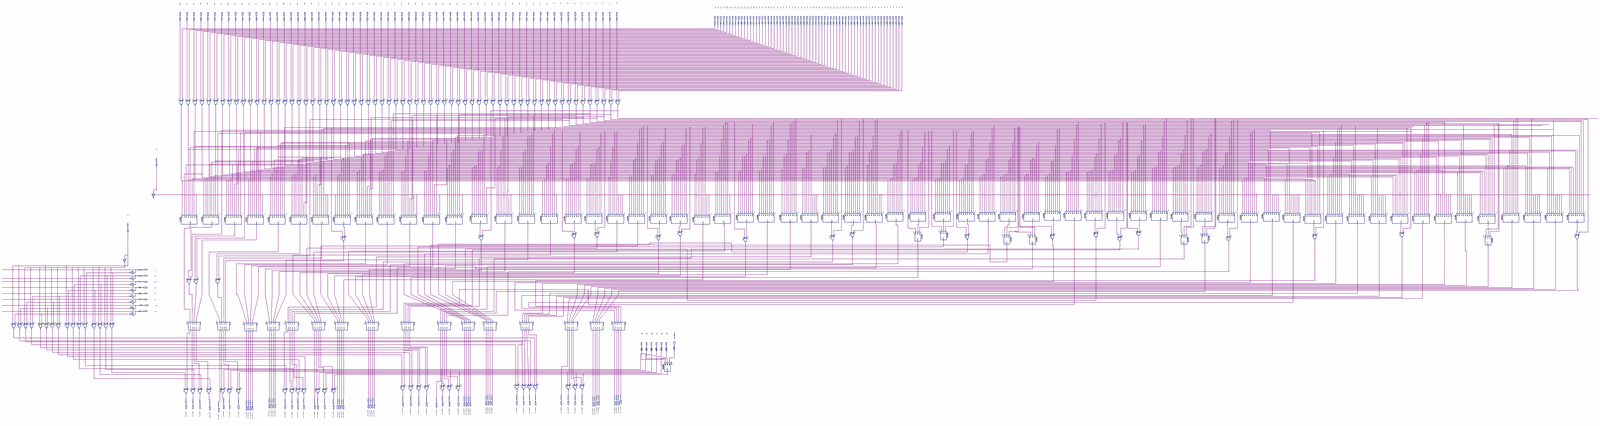
[diagram p0: schematic sheet, whole]
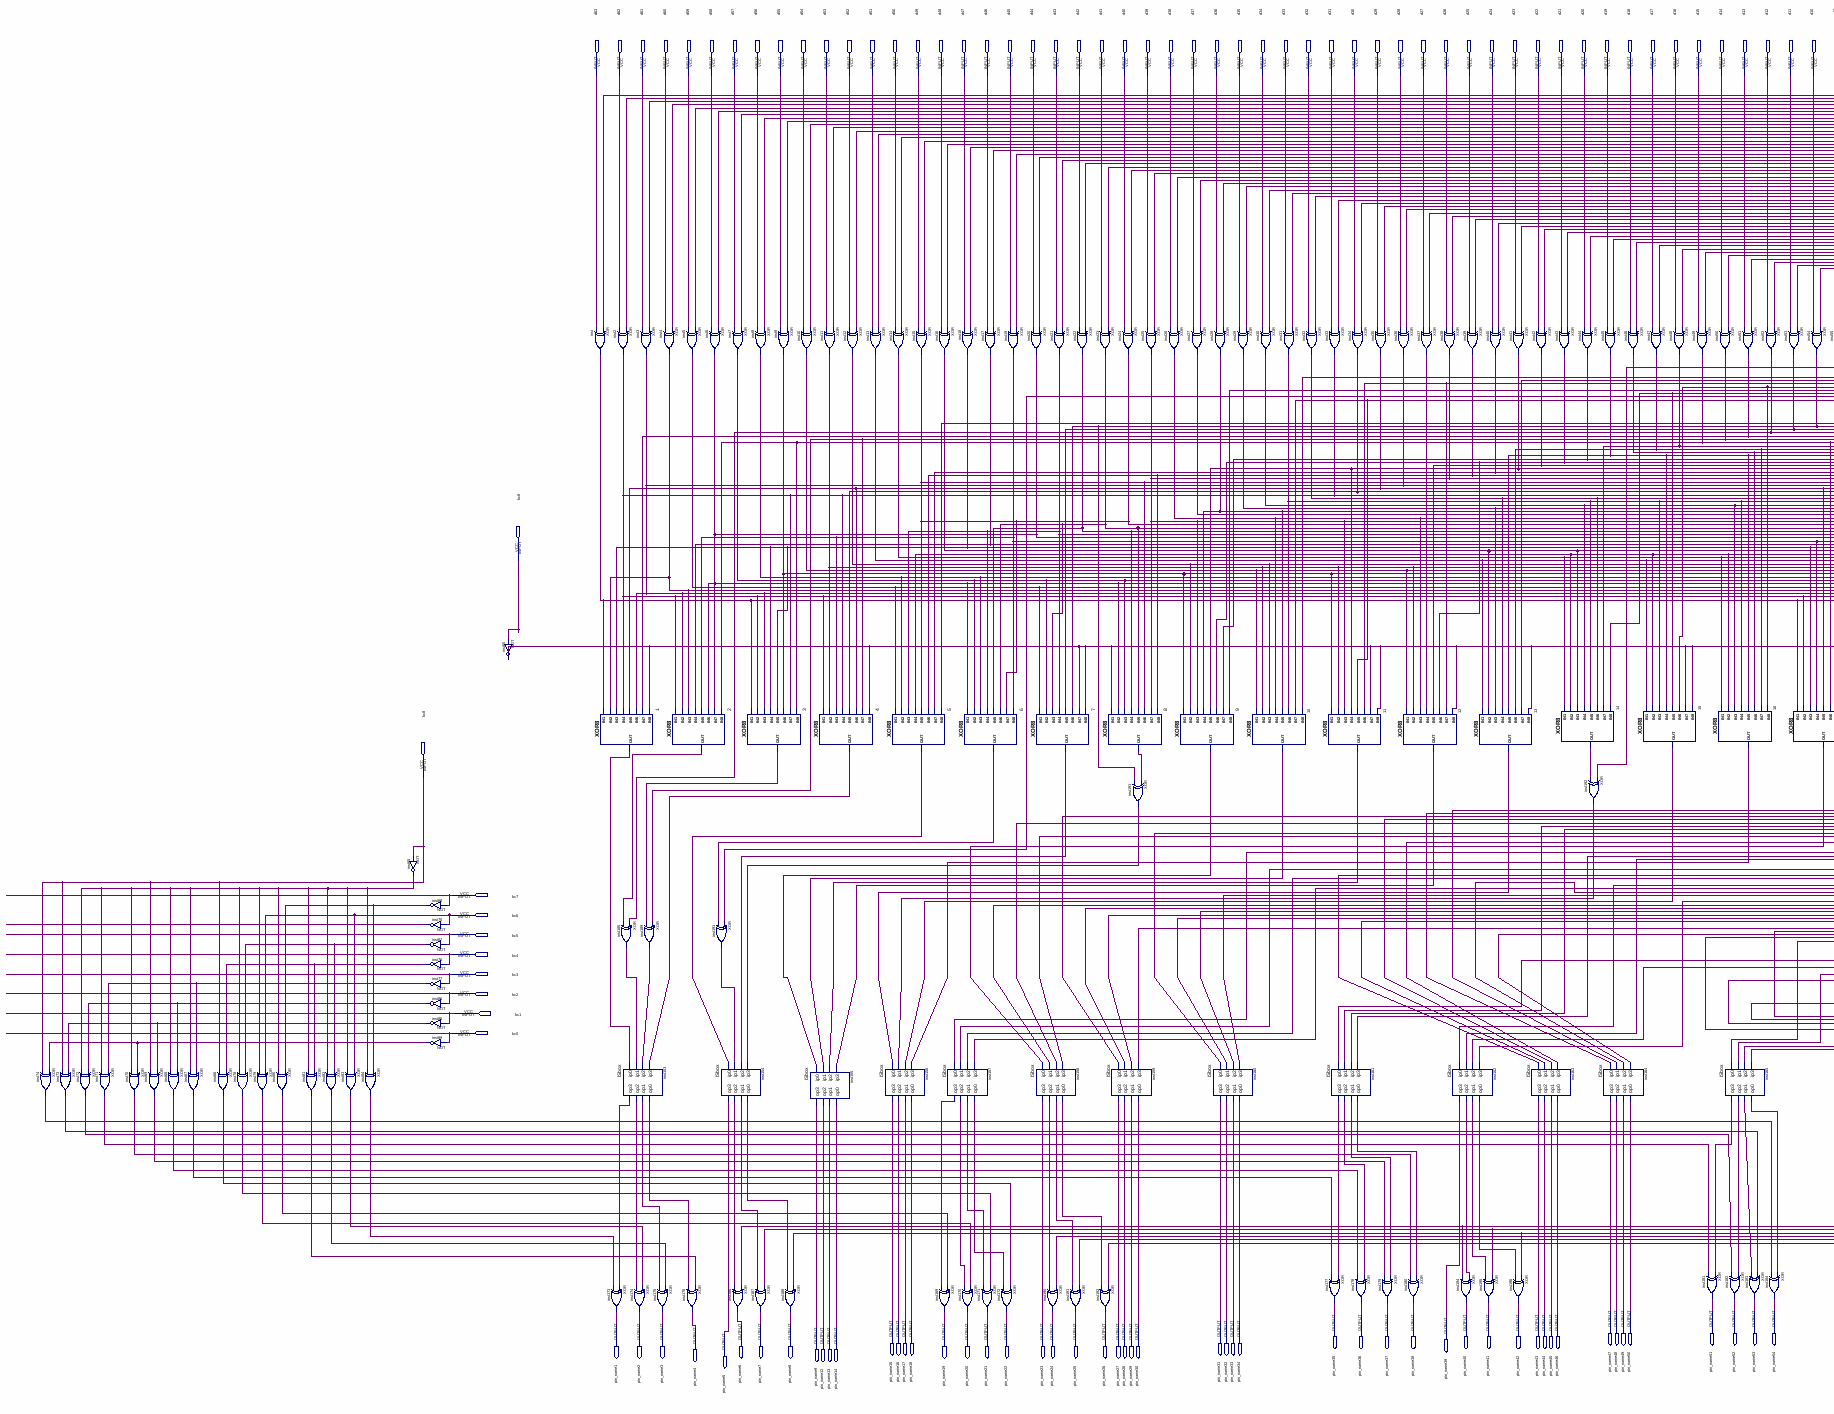
[diagram p1: schematic sheet, left part]
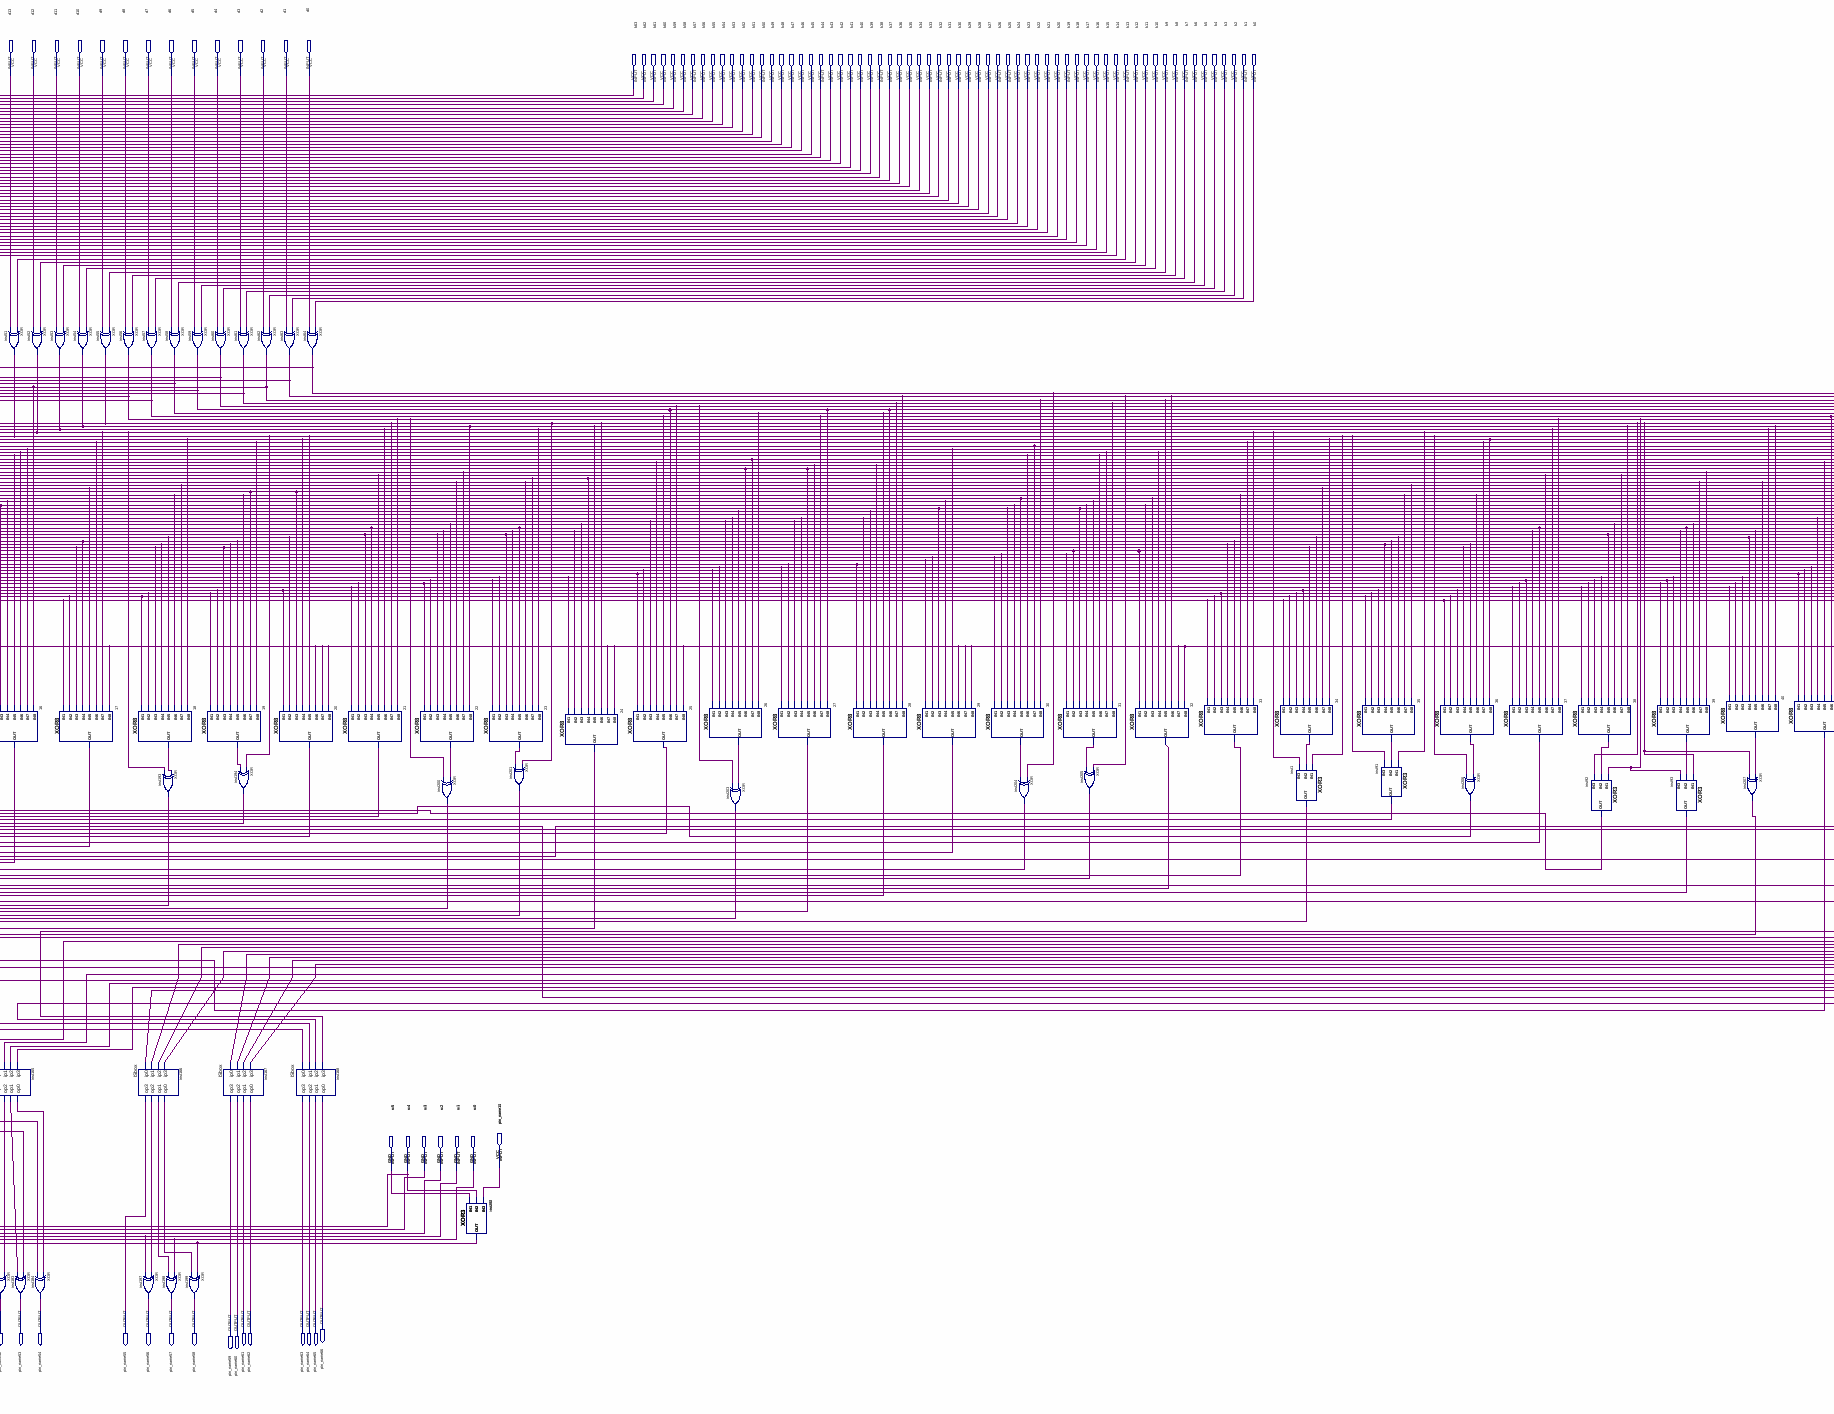
[diagram p2: schematic sheet, centre part]
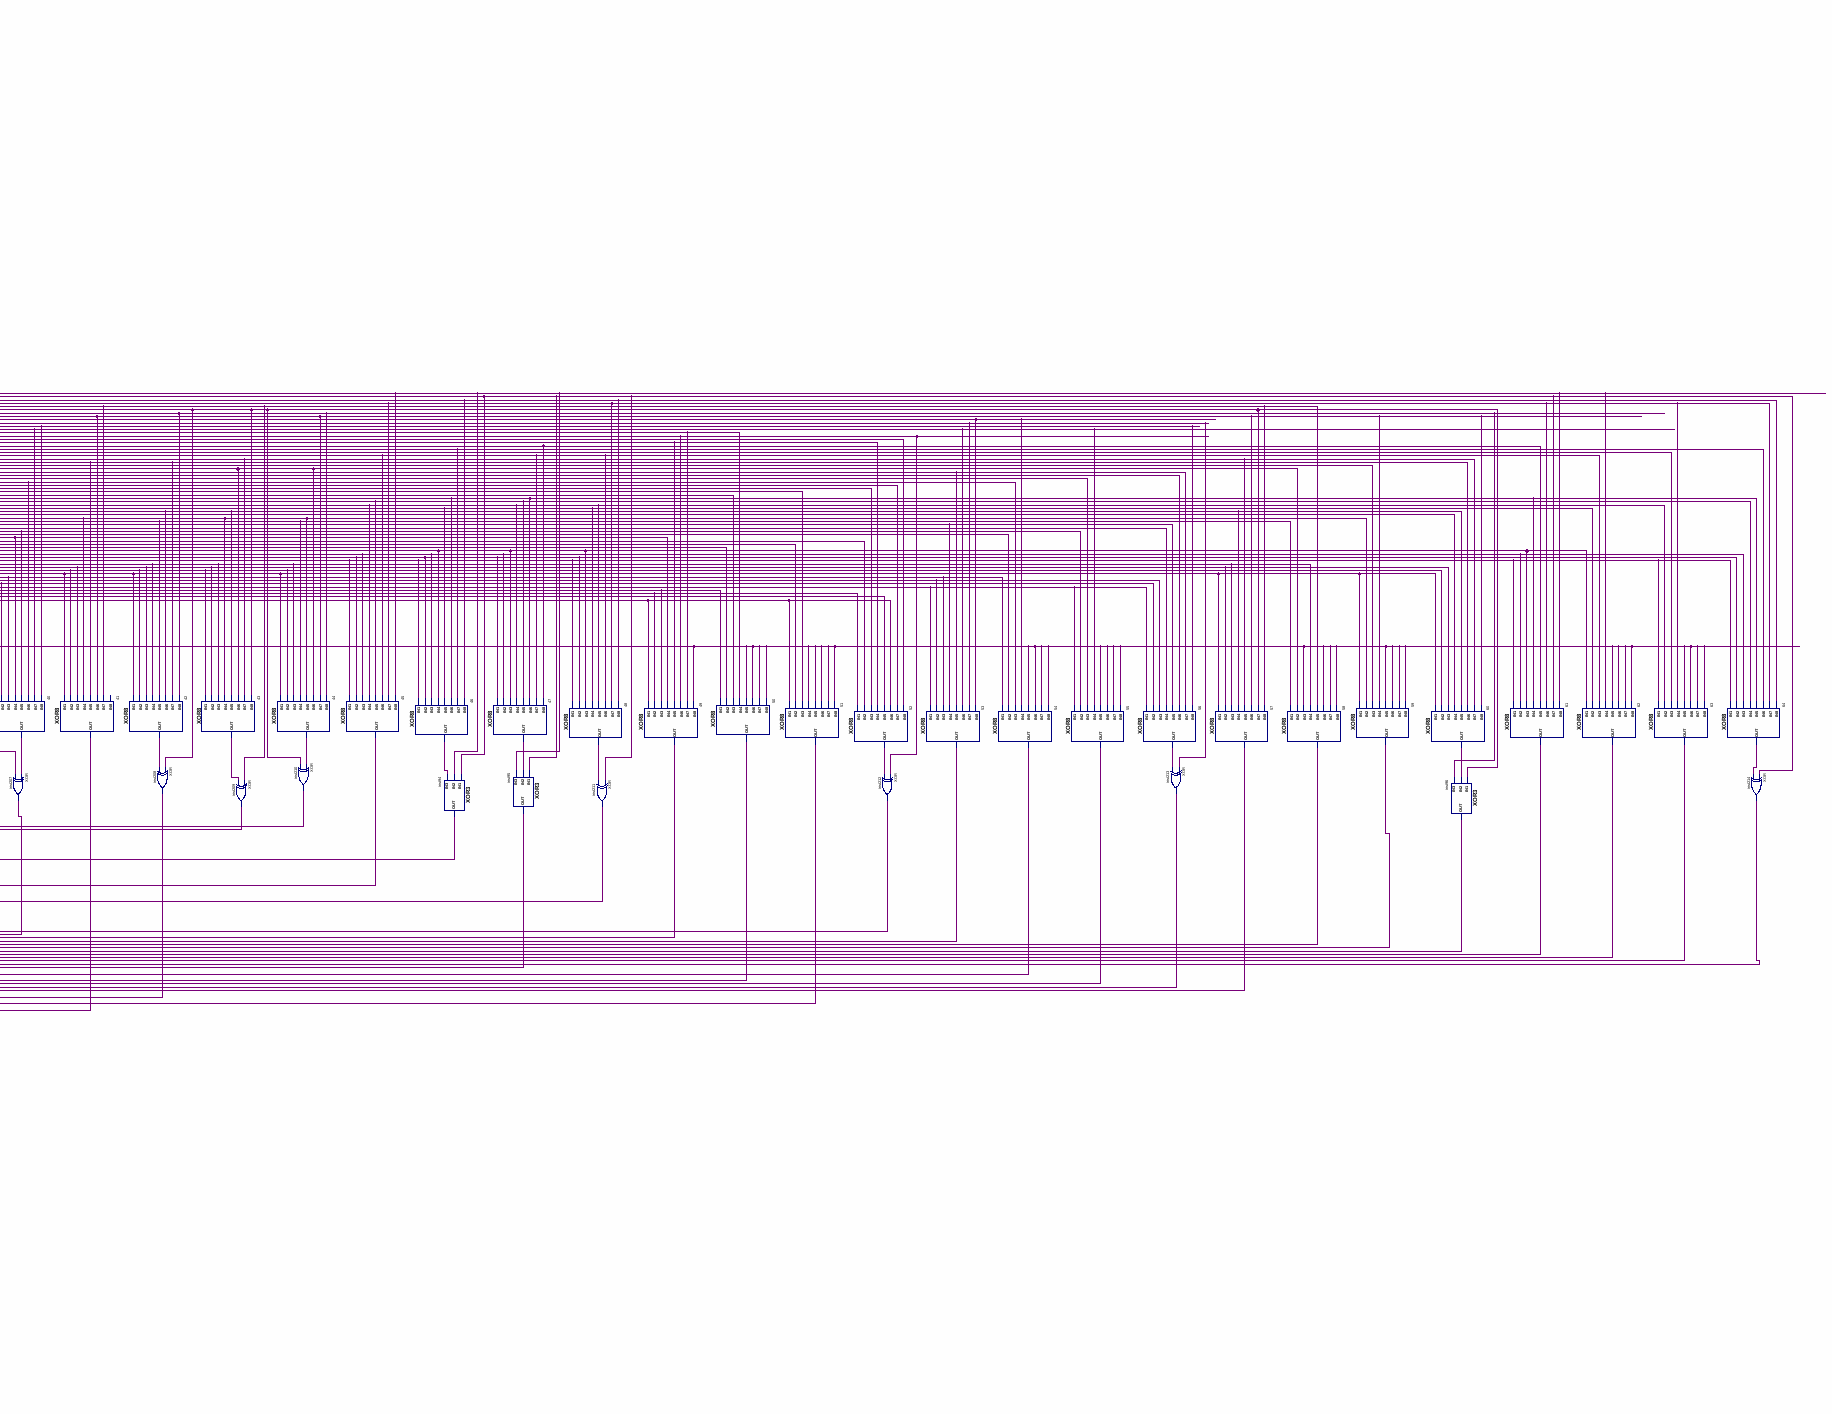
[diagram p3: schematic sheet, right part]
// Quartus schematic plain text.bdf as structural Verilog: 228 symbols, 216 pins
module \plain_text  (
  input  d63,
  input  d62,
  input  d61,
  input  d60,
  input  d59,
  input  d58,
  input  d57,
  input  d56,
  input  d55,
  input  d54,
  input  d53,
  input  d52,
  input  d51,
  input  d50,
  input  d49,
  input  d48,
  input  d47,
  input  d46,
  input  d45,
  input  d44,
  input  d43,
  input  d42,
  input  d41,
  input  d40,
  input  d39,
  input  d38,
  input  d37,
  input  d36,
  input  d35,
  input  d34,
  input  d33,
  input  d32,
  input  d31,
  input  d30,
  input  d29,
  input  d28,
  input  d27,
  input  d26,
  input  d25,
  input  d24,
  input  d23,
  input  d22,
  input  d21,
  input  d20,
  input  d19,
  input  d18,
  input  d17,
  input  d16,
  input  d15,
  input  d14,
  input  d13,
  input  d12,
  input  d11,
  input  d10,
  input  d9,
  input  d8,
  input  d7,
  input  d6,
  input  d5,
  input  d4,
  input  d3,
  input  d2,
  input  d1,
  input  d0,
  input  k63,
  input  k62,
  input  k61,
  input  k60,
  input  k59,
  input  k58,
  input  k57,
  input  k56,
  input  k55,
  input  k54,
  input  k53,
  input  k52,
  input  k51,
  input  k50,
  input  k49,
  input  k48,
  input  k47,
  input  k46,
  input  k45,
  input  k44,
  input  k43,
  input  k42,
  input  k41,
  input  k40,
  input  k39,
  input  k38,
  input  k37,
  input  k36,
  input  k35,
  input  k34,
  input  k33,
  input  k32,
  input  k31,
  input  k30,
  input  k29,
  input  k28,
  input  k27,
  input  k26,
  input  k25,
  input  k24,
  input  k23,
  input  k22,
  input  k21,
  input  k20,
  input  k19,
  input  k18,
  input  k17,
  input  k16,
  input  k15,
  input  k14,
  input  k13,
  input  k12,
  input  k11,
  input  k10,
  input  k9,
  input  k8,
  input  k7,
  input  k6,
  input  k5,
  input  k4,
  input  k3,
  input  k2,
  input  k1,
  input  k0,
  input  kc8,
  input  kc7,
  input  kc6,
  input  kc5,
  input  kc4,
  input  kc3,
  input  kc2,
  input  kc1,
  input  kc0,
  input  pin_name10,
  input  pin_name11,
  input  rc5,
  input  rc4,
  input  rc3,
  input  rc2,
  input  rc1,
  input  rc0,
  output pin_name66,
  output pin_name47,
  output pin_name48,
  output pin_name49,
  output pin_name50,
  output pin_name51,
  output pin_name52,
  output pin_name53,
  output pin_name54,
  output pin_name55,
  output pin_name56,
  output pin_name57,
  output pin_name58,
  output pin_name61,
  output pin_name62,
  output pin_name63,
  output pin_name64,
  output pin_name65,
  output pin_name35,
  output pin_name36,
  output pin_name37,
  output pin_name38,
  output pin_name40,
  output pin_name41,
  output pin_name42,
  output pin_name43,
  output pin_name44,
  output pin_name45,
  output pin_name46,
  output pin_name59,
  output pin_name60,
  output pin_name39,
  output pin_name15,
  output pin_name16,
  output pin_name17,
  output pin_name18,
  output pin_name31,
  output pin_name32,
  output pin_name33,
  output pin_name34,
  output pin_name1,
  output pin_name2,
  output pin_name3,
  output pin_name6,
  output pin_name7,
  output pin_name8,
  output pin_name19,
  output pin_name20,
  output pin_name21,
  output pin_name22,
  output pin_name23,
  output pin_name24,
  output pin_name25,
  output pin_name26,
  output pin_name27,
  output pin_name28,
  output pin_name29,
  output pin_name30,
  output pin_name4,
  output pin_name9,
  output pin_name12,
  output pin_name13,
  output pin_name14,
  output pin_name5
);

  wire inst1_out, inst2_out, inst3_out, inst4_out, inst5_out, inst6_out, inst7_out, inst8_out, inst9_out,
       inst10_out, inst11_out, inst12_out, inst13_out, inst14_out, inst15_out, inst16_out, inst17_out,
       inst18_out, inst19_out, inst21_out, inst22_out, inst23_out, inst25_out, inst26_out, inst27_out,
       inst28_out, inst29_out, inst30_out, inst31_out, inst32_out, inst34_out, inst35_out, inst39_out,
       inst40_out, inst41_out, inst42_out, inst43_out, inst44_out, inst45_out, inst46_out, inst47_out,
       inst48_out, inst49_out, inst50_out, inst51_out, inst52_out, inst53_out, inst54_out, inst55_out,
       inst56_out, inst57_out, inst58_out, inst59_out, inst60_out, inst61_out, inst62_out, inst63_out,
       inst64_out, inst65_out, inst65_out_2, inst66_out, inst67_out, inst68_out, inst69_out, inst70_out,
       inst71_out, inst72_out, inst73_out, inst74_out, inst75_out, inst76_out, inst77_out, inst78_out,
       inst79_out, inst80_out, inst81_out, inst82_out, inst83_out, inst84_out, inst85_out, inst86_out,
       inst87_out, inst88_out, inst89_out, inst90_out, inst91_out, inst92_out, inst93_out, inst94_out,
       inst95_out, inst96_out, inst153_op0, inst153_op1, inst153_op2, inst153_op3, inst154_op0, inst154_op1,
       inst154_op2, inst157_op0, inst157_op1, inst157_op2, inst157_op3, inst158_op0, inst158_op1,
       inst158_op2, inst161_op0, inst161_op1, inst161_op2, inst161_op3, inst162_op0, inst162_op1,
       inst162_op2, inst165_op0, inst165_op1, inst165_op2, inst165_op3, inst166_op0, inst166_op1,
       inst166_op2, inst185_out, inst189_out, inst191_out, inst191_out_2, inst192_out, inst193_out,
       inst194_out, inst200_out, inst201_out, inst203_out, inst204_out, inst205_out, inst206_out,
       inst207_out, inst208_out, inst209_out, inst210_out, inst211_out, inst212_out, inst213_out,
       inst214_out, inst_out, n1_out, n2_out, n3_out, n4_out, n5_out, n6_out, n7_out, n8_out, n9_out,
       n10_out, n11_out, n12_out, n13_out, n14_out, n15_out, n16_out, n17_out, n18_out, n19_out, n20_out,
       n21_out, n22_out, n23_out, n24_out, n25_out, n26_out, n27_out, n28_out, n29_out, n30_out, n31_out,
       n32_out, n33_out, n34_out, n35_out, n36_out, n37_out, n38_out, n39_out, n40_out, n41_out, n42_out,
       n43_out, n44_out, n45_out, n46_out, n47_out, n48_out, n49_out, n50_out, n51_out, n52_out, n53_out,
       n54_out, n55_out, n56_out, n57_out, n58_out, n59_out, n60_out, n61_out, n62_out, n63_out, n64_out;

  xor inst73 (inst73_out, inst85_out, kc8);
  xor inst74 (inst74_out, inst89_out, kc8);
  xor inst72 (inst72_out, inst86_out, inst65_out);
  xor inst71 (inst71_out, inst77_out, inst65_out);
  xor inst70 (inst70_out, inst89_out, inst65_out);
  xor inst69 (inst69_out, inst85_out, kc8);
  xor inst67 (inst67_out, inst77_out, inst65_out);
  xor inst68 (inst68_out, inst86_out, inst65_out);
  xor inst66 (inst66_out, inst76_out, kc8);
  xor inst78 (inst78_out, inst87_out, inst65_out);
  xor inst79 (inst79_out, kc6, inst65_out);
  xor inst80 (inst80_out, inst88_out, inst65_out);
  xor inst81 (inst81_out, inst76_out, inst65_out);
  xor inst82 (inst82_out, inst87_out, inst65_out);
  xor inst83 (inst83_out, kc6, inst65_out);
  xor inst84 (inst84_out, inst88_out, inst65_out);
  not inst65 (inst65_out, kc8);
  not inst88 (inst88_out, kc7);
  not inst75 (inst75_out, kc6);
  not inst87 (inst87_out, kc5);
  not inst76 (inst76_out, kc4);
  not inst77 (inst77_out, kc3);
  not inst86 (inst86_out, kc2);
  not inst85 (inst85_out, kc1);
  not inst89 (inst89_out, kc0);
  not inst65_dup2 (inst65_out_2, kc8);
  xor inst (inst_out, k63, d63);
  XOR8 u_1 (
    .IN8(inst65_out_2), .IN1(inst_out), .IN7(inst51_out), .IN6(inst3_out), .IN5(inst35_out), .IN4(inst2_out),
    .IN3(inst18_out), .IN2(inst4_out), .OUT(n1_out));
  xor inst173 (pin_name1, inst153_op3, inst84_out);
  xor inst2 (inst2_out, k62, d62);
  xor inst185 (inst185_out, inst52_out, n2_out);
  ISbox inst153 (
    .ip0(n1_out), .ip1(inst185_out), .ip2(inst189_out), .ip3(n4_out), .op3(inst153_op3), .op2(inst153_op2),
    .op1(inst153_op1), .op0(inst153_op0));
  xor inst174 (pin_name2, inst83_out, inst153_op2);
  xor inst3 (inst3_out, k61, d61);
  xor inst4 (inst4_out, k60, d60);
  xor inst189 (inst189_out, inst50_out, n3_out);
  xor inst175 (pin_name3, inst82_out, inst153_op1);
  xor inst5 (inst5_out, k59, d59);
  XOR8 u_2 (
    .IN8(inst49_out), .IN1(inst2_out), .IN7(inst6_out), .IN6(inst6_out), .IN5(inst19_out), .IN4(inst17_out),
    .IN3(inst4_out), .IN2(inst3_out), .OUT(n2_out));
  xor inst176 (pin_name4, inst81_out, inst153_op0);
  xor inst6 (inst6_out, k58, d58);
  xor inst191 (inst191_out, inst56_out, n6_out);
  xor inst7 (inst7_out, k57, d57);
  ISbox inst154 (
    .ip0(n5_out), .ip1(inst191_out), .ip2(n7_out), .ip3(inst191_out_2), .op3(pin_name5), .op2(inst154_op2),
    .op1(inst154_op1), .op0(inst154_op0));
  xor inst186 (pin_name6, rc4, inst154_op2);
  xor inst8 (inst8_out, k56, d56);
  XOR8 u_3 (
    .IN8(inst49_out), .IN1(inst_out), .IN7(inst2_out), .IN6(inst9_out), .IN5(inst18_out), .IN4(inst18_out),
    .IN3(inst3_out), .IN2(inst2_out), .OUT(n3_out));
  xor inst187 (pin_name7, rc3, inst154_op1);
  xor inst9 (inst9_out, k55, d55);
  xor inst188 (pin_name8, rc2, inst154_op0);
  xor inst10 (inst10_out, k54, d54);
  XOR8 u_4 (
    .IN8(inst65_out_2), .IN1(inst2_out), .IN7(inst50_out), .IN6(inst35_out), .IN5(inst34_out),
    .IN4(inst2_out), .IN3(inst19_out), .IN2(inst11_out), .OUT(n4_out));
  ISbox inst155 (
    .ip0(n9_out), .ip1(n10_out), .ip2(n11_out), .ip3(n12_out), .op3(pin_name9), .op2(pin_name12),
    .op1(pin_name13), .op0(pin_name14));
  xor inst11 (inst11_out, k53, d53);
  xor inst12 (inst12_out, k52, d52);
  xor inst13 (inst13_out, k51, d51);
  xor inst14 (inst14_out, k50, d50);
  XOR8 u_5 (
    .IN8(inst55_out), .IN1(inst5_out), .IN7(inst40_out), .IN6(inst39_out), .IN5(inst15_out),
    .IN4(inst15_out), .IN3(inst21_out), .IN2(inst8_out), .OUT(n5_out));
  ISbox inst156 (
    .ip0(n13_out), .ip1(inst192_out), .ip2(n15_out), .ip3(n16_out), .op3(pin_name15), .op2(pin_name16),
    .op1(pin_name17), .op0(pin_name18));
  xor inst15 (inst15_out, k49, d49);
  xor inst16 (inst16_out, k48, d48);
  ISbox inst157 (
    .ip0(n29_out), .ip1(inst204_out), .ip2(inst205_out), .ip3(n32_out), .op3(inst157_op3), .op2(inst157_op2),
    .op1(inst157_op1), .op0(inst157_op0));
  xor inst169 (pin_name19, inst80_out, inst157_op3);
  xor inst18 (inst18_out, k47, d47);
  XOR8 u_6 (
    .IN8(inst19_out), .IN1(inst6_out), .IN7(inst15_out), .IN6(inst23_out), .IN5(inst22_out),
    .IN4(inst21_out), .IN3(inst8_out), .IN2(inst7_out), .OUT(n6_out));
  xor inst170 (pin_name20, inst79_out, inst157_op2);
  xor inst17 (inst17_out, k46, d46);
  xor inst171 (pin_name21, inst78_out, inst157_op1);
  xor inst172 (pin_name22, inst66_out, inst157_op0);
  xor inst19 (inst19_out, k45, d45);
  xor inst20 (inst6_out, k44, d44);
  xor inst21 (inst21_out, k43, d43);
  XOR8 u_7 (
    .IN8(inst65_out_2), .IN1(inst5_out), .IN7(inst65_out_2), .IN6(inst54_out), .IN5(inst53_out),
    .IN4(inst21_out), .IN3(inst23_out), .IN2(inst7_out), .OUT(n7_out));
  ISbox inst158 (
    .ip0(n17_out), .ip1(inst193_out), .ip2(inst194_out), .ip3(n20_out), .op3(pin_name23), .op2(inst158_op2),
    .op1(inst158_op1), .op0(inst158_op0));
  xor inst190 (pin_name24, rc1, inst158_op2);
  xor inst22 (inst22_out, k42, d42);
  xor inst191_dup2 (pin_name25, rc0, inst158_op1);
  xor inst23 (inst23_out, k41, d41);
  XOR8 u_8 (
    .IN8(inst39_out), .IN1(inst65_out_2), .IN7(inst25_out), .IN6(inst15_out), .IN5(inst23_out),
    .IN4(inst22_out), .IN3(inst7_out), .IN2(inst6_out), .OUT(n8_out));
  ISbox inst159 (
    .ip0(n21_out), .ip1(inst200_out), .ip2(inst201_out), .ip3(n24_out), .op3(pin_name27), .op2(pin_name28),
    .op1(pin_name29), .op0(pin_name30));
  xor inst192 (pin_name26, inst90_out, inst158_op0);
  xor inst24 (inst15_out, k40, d40);
  xor inst191_dup3 (inst191_out_2, n8_out, inst54_out);
  xor inst25 (inst25_out, k39, d39);
  xor inst26 (inst26_out, k38, d38);
  XOR8 u_9 (
    .IN8(inst59_out), .IN1(inst9_out), .IN7(inst44_out), .IN6(inst43_out), .IN5(inst41_out),
    .IN4(inst28_out), .IN3(inst25_out), .IN2(inst12_out), .OUT(n9_out));
  xor inst27 (inst27_out, k37, d37);
  xor inst28 (inst28_out, k36, d36);
  ISbox inst160 (
    .ip0(n25_out), .ip1(inst203_out), .ip2(n27_out), .ip3(n28_out), .op3(pin_name31), .op2(pin_name32),
    .op1(pin_name33), .op0(pin_name34));
  xor inst29 (inst29_out, k35, d35);
  xor inst30 (inst30_out, k34, d34);
  XOR8 u_10 (
    .IN8(inst60_out), .IN1(inst10_out), .IN7(inst57_out), .IN6(inst31_out), .IN5(inst28_out),
    .IN4(inst26_out), .IN3(inst12_out), .IN2(inst11_out), .OUT(n10_out));
  xor inst31 (inst31_out, k33, d33);
  xor inst32 (inst32_out, k32, d32);
  xor inst33 (inst2_out, k31, d31);
  XOR8 u_11 (
    .IN8(inst65_out_2), .IN1(inst9_out), .IN7(inst65_out_2), .IN6(inst58_out), .IN5(inst57_out),
    .IN4(inst41_out), .IN3(inst25_out), .IN2(inst11_out), .OUT(n11_out));
  ISbox inst161 (
    .ip0(n41_out), .ip1(inst208_out), .ip2(inst209_out), .ip3(inst210_out), .op3(inst161_op3),
    .op2(inst161_op2), .op1(inst161_op1), .op0(inst161_op0));
  xor inst177 (pin_name35, inst161_op3, inst67_out);
  xor inst34 (inst34_out, k30, d30);
  xor inst178 (pin_name36, inst161_op2, inst68_out);
  xor inst35 (inst35_out, k29, d29);
  xor inst36 (inst3_out, k28, d28);
  xor inst179 (pin_name37, inst161_op1, inst69_out);
  xor inst37 (inst15_out, k27, d27);
  XOR8 u_12 (
    .IN8(inst65_out_2), .IN1(inst10_out), .IN7(inst58_out), .IN6(inst43_out), .IN5(inst42_out),
    .IN4(inst15_out), .IN3(inst26_out), .IN2(inst11_out), .OUT(n12_out));
  xor inst180 (pin_name38, inst161_op0, inst70_out);
  xor inst38 (inst25_out, k26, d26);
  ISbox inst162 (
    .ip0(n45_out), .ip1(inst94_out), .ip2(inst95_out), .ip3(inst211_out), .op3(pin_name39),
    .op2(inst162_op2), .op1(inst162_op1), .op0(inst162_op0));
  xor inst39 (inst39_out, k25, d25);
  XOR8 u_13 (
    .IN8(inst65_out_2), .IN1(inst13_out), .IN7(inst63_out), .IN6(inst47_out), .IN5(inst45_out),
    .IN4(inst32_out), .IN3(inst29_out), .IN2(inst16_out), .OUT(n13_out));
  xor inst194 (pin_name40, inst162_op2, rc4);
  xor inst40 (inst40_out, k24, d24);
  xor inst195 (pin_name41, rc3, inst162_op1);
  xor inst41 (inst41_out, k23, d23);
  ISbox inst163 (
    .ip0(n33_out), .ip1(inst1_out), .ip2(inst91_out), .ip3(n37_out), .op3(pin_name43), .op2(pin_name44),
    .op1(pin_name45), .op0(pin_name46));
  xor inst196 (pin_name42, rc2, inst162_op0);
  xor inst42 (inst42_out, k22, d22);
  xor inst43 (inst43_out, k21, d21);
  xor inst44 (inst44_out, k20, d20);
  XOR8 u_14 (
    .IN8(inst61_out), .IN1(inst14_out), .IN7(inst48_out), .IN6(inst32_out), .IN5(inst31_out),
    .IN4(inst30_out), .IN3(inst16_out), .IN2(inst15_out), .OUT(n14_out));
  xor inst45 (inst45_out, k19, d19);
  xor inst192_dup2 (inst192_out, inst64_out, n14_out);
  ISbox inst164 (
    .ip0(inst206_out), .ip1(inst92_out), .ip2(inst93_out), .ip3(inst207_out), .op3(pin_name47),
    .op2(pin_name48), .op1(pin_name49), .op0(pin_name50));
  xor inst46 (inst46_out, k18, d18);
  xor inst47 (inst47_out, k17, d17);
  XOR8 u_15 (
    .IN8(inst65_out_2), .IN1(inst13_out), .IN7(inst65_out_2), .IN6(inst62_out), .IN5(inst61_out),
    .IN4(inst45_out), .IN3(inst31_out), .IN2(inst15_out), .OUT(n15_out));
  xor inst48 (inst48_out, k16, d16);
  xor inst49 (inst49_out, k15, d15);
  xor inst181 (pin_name51, inst165_op3, inst71_out);
  xor inst50 (inst50_out, k14, d14);
  XOR8 u_16 (
    .IN8(inst62_out), .IN1(inst14_out), .IN7(inst47_out), .IN6(inst46_out), .IN5(inst45_out),
    .IN4(inst31_out), .IN3(inst30_out), .IN2(inst15_out), .OUT(n16_out));
  ISbox inst165 (
    .ip0(n53_out), .ip1(n54_out), .ip2(n55_out), .ip3(inst213_out), .op3(inst165_op3), .op2(inst165_op2),
    .op1(inst165_op1), .op0(inst165_op0));
  xor inst182 (pin_name52, inst165_op2, inst72_out);
  xor inst51 (inst51_out, k13, d13);
  xor inst52 (inst52_out, k12, d12);
  xor inst183 (pin_name53, inst73_out, inst165_op1);
  xor inst53 (inst53_out, k11, d11);
  XOR8 u_17 (
    .IN8(inst65_out_2), .IN1(inst_out), .IN7(inst52_out), .IN6(inst49_out), .IN5(inst35_out),
    .IN4(inst19_out), .IN3(inst18_out), .IN2(inst2_out), .OUT(n17_out));
  xor inst184 (pin_name54, inst165_op0, inst74_out);
  xor inst54 (inst54_out, k10, d10);
  xor inst55 (inst55_out, k9, d9);
  xor inst56 (inst56_out, k8, d8);
  XOR8 u_18 (
    .IN8(inst50_out), .IN1(inst2_out), .IN7(inst3_out), .IN6(inst2_out), .IN5(inst6_out), .IN4(inst17_out),
    .IN3(inst18_out), .IN2(inst3_out), .OUT(n18_out));
  ISbox inst166 (
    .ip0(n57_out), .ip1(n58_out), .ip2(n59_out), .ip3(inst96_out), .op3(pin_name55), .op2(inst166_op2),
    .op1(inst166_op1), .op0(inst166_op0));
  xor inst57 (inst57_out, k7, d7);
  xor inst193 (inst193_out, n18_out, inst52_out);
  xor inst197 (pin_name56, inst166_op2, rc1);
  xor inst58 (inst58_out, k6, d6);
  xor inst198 (pin_name57, rc0, inst166_op1);
  xor inst199 (pin_name58, inst90_out, inst166_op0);
  xor inst59 (inst59_out, k5, d5);
  xor inst60 (inst60_out, k4, d4);
  XOR8 u_19 (
    .IN8(inst49_out), .IN1(inst3_out), .IN7(inst34_out), .IN6(inst2_out), .IN5(inst19_out), .IN4(inst17_out),
    .IN3(inst18_out), .IN2(inst4_out), .OUT(n19_out));
  xor inst61 (inst61_out, k3, d3);
  xor inst194_dup2 (inst194_out, inst51_out, n19_out);
  ISbox inst167 (
    .ip0(n61_out), .ip1(n62_out), .ip2(n63_out), .ip3(inst214_out), .op3(pin_name59), .op2(pin_name60),
    .op1(pin_name61), .op0(pin_name62));
  xor inst62 (inst62_out, k2, d2);
  xor inst63 (inst63_out, k1, d1);
  XOR8 u_20 (
    .IN8(inst65_out_2), .IN1(inst4_out), .IN7(inst65_out_2), .IN6(inst65_out_2), .IN5(inst51_out),
    .IN4(inst50_out), .IN3(inst34_out), .IN2(inst6_out), .OUT(n20_out));
  ISbox inst168 (
    .ip0(n49_out), .ip1(n50_out), .ip2(n51_out), .ip3(inst212_out), .op3(pin_name63), .op2(pin_name64),
    .op1(pin_name65), .op0(pin_name66));
  xor inst64 (inst64_out, k0, d0);
  XOR8 u_21 (
    .IN8(inst56_out), .IN1(inst5_out), .IN7(inst55_out), .IN6(inst53_out), .IN5(inst39_out),
    .IN4(inst23_out), .IN3(inst21_out), .IN2(inst6_out), .OUT(n21_out));
  XOR8 u_22 (
    .IN8(inst54_out), .IN1(inst6_out), .IN7(inst40_out), .IN6(inst15_out), .IN5(inst15_out),
    .IN4(inst22_out), .IN3(inst21_out), .IN2(inst7_out), .OUT(n22_out));
  xor inst200 (inst200_out, n22_out, inst56_out);
  XOR3 inst90 (.IN3(pin_name10), .IN1(rc4), .IN2(rc4), .OUT(inst90_out));
  XOR3 inst202 (.IN3(pin_name10), .IN1(rc4), .IN2(rc4), .OUT(inst90_out));
  XOR8 u_23 (
    .IN8(inst53_out), .IN1(inst7_out), .IN7(inst25_out), .IN6(inst15_out), .IN5(inst23_out),
    .IN4(inst22_out), .IN3(inst21_out), .IN2(inst8_out), .OUT(n23_out));
  xor inst201 (inst201_out, inst55_out, n23_out);
  XOR8 u_24 (
    .IN8(inst65_out_2), .IN1(inst8_out), .IN7(inst65_out_2), .IN6(inst55_out), .IN5(inst54_out),
    .IN4(inst25_out), .IN3(inst15_out), .IN2(inst22_out), .OUT(n24_out));
  XOR8 u_25 (
    .IN8(inst65_out_2), .IN1(inst9_out), .IN7(inst60_out), .IN6(inst59_out), .IN5(inst57_out),
    .IN4(inst43_out), .IN3(inst25_out), .IN2(inst10_out), .OUT(n25_out));
  XOR8 u_26 (
    .IN8(inst58_out), .IN1(inst10_out), .IN7(inst44_out), .IN6(inst41_out), .IN5(inst28_out),
    .IN4(inst26_out), .IN3(inst25_out), .IN2(inst11_out), .OUT(n26_out));
  xor inst203 (inst203_out, n26_out, inst60_out);
  XOR8 u_27 (
    .IN8(inst59_out), .IN1(inst11_out), .IN7(inst57_out), .IN6(inst42_out), .IN5(inst41_out),
    .IN4(inst26_out), .IN3(inst25_out), .IN2(inst12_out), .OUT(n27_out));
  XOR8 u_28 (
    .IN8(inst63_out), .IN1(inst12_out), .IN7(inst61_out), .IN6(inst59_out), .IN5(inst58_out),
    .IN4(inst42_out), .IN3(inst28_out), .IN2(inst26_out), .OUT(n28_out));
  XOR8 u_29 (
    .IN8(inst65_out_2), .IN1(inst13_out), .IN7(inst65_out_2), .IN6(inst65_out_2), .IN5(inst47_out),
    .IN4(inst31_out), .IN3(inst29_out), .IN2(inst14_out), .OUT(n29_out));
  XOR8 u_30 (
    .IN8(inst62_out), .IN1(inst14_out), .IN7(inst48_out), .IN6(inst45_out), .IN5(inst32_out),
    .IN4(inst30_out), .IN3(inst29_out), .IN2(inst15_out), .OUT(n30_out));
  xor inst204 (inst204_out, inst64_out, n30_out);
  XOR8 u_31 (
    .IN8(inst61_out), .IN1(inst15_out), .IN7(inst46_out), .IN6(inst45_out), .IN5(inst31_out),
    .IN4(inst30_out), .IN3(inst29_out), .IN2(inst16_out), .OUT(n31_out));
  xor inst205 (inst205_out, inst63_out, n31_out);
  XOR8 u_32 (
    .IN8(inst65_out_2), .IN1(inst16_out), .IN7(inst65_out_2), .IN6(inst63_out), .IN5(inst62_out),
    .IN4(inst46_out), .IN3(inst32_out), .IN2(inst30_out), .OUT(n32_out));
  XOR8 u_33 (
    .IN8(inst52_out), .IN1(inst_out), .IN7(inst49_out), .IN6(inst2_out), .IN5(inst19_out), .IN4(inst17_out),
    .IN3(inst3_out), .IN2(inst2_out), .OUT(n33_out));
  XOR8 u_34 (
    .IN8(inst50_out), .IN1(inst_out), .IN7(inst35_out), .IN6(inst6_out), .IN5(inst18_out), .IN4(inst4_out),
    .IN3(inst3_out), .IN2(inst2_out), .OUT(n34_out));
  XOR3 inst1 (.IN3(inst52_out), .IN1(inst51_out), .IN2(n34_out), .OUT(inst1_out));
  XOR8 u_35 (
    .IN8(inst3_out), .IN1(inst2_out), .IN7(inst2_out), .IN6(inst6_out), .IN5(inst19_out), .IN4(inst17_out),
    .IN3(inst4_out), .IN2(inst3_out), .OUT(n35_out));
  XOR3 inst91 (.IN3(inst51_out), .IN1(inst52_out), .IN2(n35_out), .OUT(inst91_out));
  XOR8 u_36 (
    .IN8(inst50_out), .IN1(inst_out), .IN7(inst49_out), .IN6(inst2_out), .IN5(inst17_out), .IN4(inst18_out),
    .IN3(inst4_out), .IN2(inst2_out), .OUT(n36_out));
  xor inst206 (inst206_out, n36_out, inst51_out);
  XOR8 u_37 (
    .IN8(inst56_out), .IN1(inst5_out), .IN7(inst53_out), .IN6(inst39_out), .IN5(inst23_out),
    .IN4(inst22_out), .IN3(inst7_out), .IN2(inst6_out), .OUT(n37_out));
  XOR8 u_38 (
    .IN8(inst54_out), .IN1(inst5_out), .IN7(inst39_out), .IN6(inst15_out), .IN5(inst21_out), .IN4(inst8_out),
    .IN3(inst7_out), .IN2(inst6_out), .OUT(n38_out));
  XOR3 inst92 (.IN3(inst55_out), .IN1(inst56_out), .IN2(n38_out), .OUT(inst92_out));
  XOR8 u_39 (
    .IN8(inst40_out), .IN1(inst6_out), .IN7(inst15_out), .IN6(inst15_out), .IN5(inst23_out),
    .IN4(inst22_out), .IN3(inst8_out), .IN2(inst7_out), .OUT(n39_out));
  XOR3 inst93 (.IN3(inst56_out), .IN1(inst55_out), .IN2(n39_out), .OUT(inst93_out));
  XOR8 u_40 (
    .IN8(inst54_out), .IN1(inst5_out), .IN7(inst53_out), .IN6(inst15_out), .IN5(inst22_out), .IN4(inst6_out),
    .IN3(inst8_out), .IN2(inst6_out), .OUT(n40_out));
  xor inst207 (inst207_out, n40_out, inst55_out);
  XOR8 u_41 (
    .IN1(inst9_out), .IN7(inst60_out), .IN6(inst57_out), .IN5(inst43_out), .IN4(inst26_out),
    .IN3(inst11_out), .IN2(inst10_out), .OUT(n41_out));  // open: IN8
  XOR8 u_42 (
    .IN8(inst58_out), .IN1(inst9_out), .IN7(inst43_out), .IN6(inst28_out), .IN5(inst25_out),
    .IN4(inst12_out), .IN3(inst11_out), .IN2(inst10_out), .OUT(n42_out));
  xor inst208 (inst208_out, inst59_out, n42_out);
  XOR8 u_43 (
    .IN8(inst59_out), .IN1(inst10_out), .IN7(inst44_out), .IN6(inst41_out), .IN5(inst28_out),
    .IN4(inst26_out), .IN3(inst12_out), .IN2(inst11_out), .OUT(n43_out));
  xor inst209 (inst209_out, inst60_out, n43_out);
  XOR8 u_44 (
    .IN8(inst58_out), .IN1(inst9_out), .IN7(inst57_out), .IN6(inst41_out), .IN5(inst26_out),
    .IN4(inst25_out), .IN3(inst12_out), .IN2(inst10_out), .OUT(n44_out));
  xor inst210 (inst210_out, n44_out, inst59_out);
  XOR8 u_45 (
    .IN8(inst64_out), .IN1(inst13_out), .IN7(inst61_out), .IN6(inst45_out), .IN5(inst31_out),
    .IN4(inst30_out), .IN3(inst15_out), .IN2(inst14_out), .OUT(n45_out));
  XOR8 u_46 (
    .IN8(inst62_out), .IN1(inst13_out), .IN7(inst47_out), .IN6(inst32_out), .IN5(inst29_out),
    .IN4(inst16_out), .IN3(inst15_out), .IN2(inst14_out), .OUT(n46_out));
  XOR3 inst94 (.IN3(n46_out), .IN1(inst63_out), .IN2(inst64_out), .OUT(inst94_out));
  XOR8 u_47 (
    .IN8(inst48_out), .IN1(inst14_out), .IN7(inst45_out), .IN6(inst32_out), .IN5(inst31_out),
    .IN4(inst30_out), .IN3(inst16_out), .IN2(inst15_out), .OUT(n47_out));
  XOR3 inst95 (.IN3(inst64_out), .IN1(inst63_out), .IN2(n47_out), .OUT(inst95_out));
  XOR8 u_48 (
    .IN8(inst62_out), .IN1(inst13_out), .IN7(inst61_out), .IN6(inst45_out), .IN5(inst30_out),
    .IN4(inst29_out), .IN3(inst16_out), .IN2(inst14_out), .OUT(n48_out));
  xor inst211 (inst211_out, inst63_out, n48_out);
  XOR8 u_49 (
    .IN8(inst65_out_2), .IN1(inst_out), .IN7(inst52_out), .IN6(inst51_out), .IN5(inst49_out),
    .IN4(inst6_out), .IN3(inst4_out), .IN2(inst3_out), .OUT(n49_out));
  XOR8 u_50 (
    .IN8(inst65_out_2), .IN1(inst4_out), .IN7(inst65_out_2), .IN6(inst65_out_2), .IN5(inst65_out_2),
    .IN4(inst52_out), .IN3(inst2_out), .IN2(inst18_out), .OUT(n50_out));
  XOR8 u_51 (
    .IN8(inst65_out_2), .IN1(inst_out), .IN7(inst65_out_2), .IN6(inst65_out_2), .IN5(inst65_out_2),
    .IN4(inst65_out_2), .IN3(inst34_out), .IN2(inst17_out), .OUT(n51_out));
  XOR8 u_52 (
    .IN8(inst50_out), .IN1(inst3_out), .IN7(inst3_out), .IN6(inst_out), .IN5(inst2_out), .IN4(inst49_out),
    .IN3(inst35_out), .IN2(inst19_out), .OUT(n52_out));
  xor inst212 (inst212_out, inst51_out, n52_out);
  XOR8 u_53 (
    .IN8(inst56_out), .IN1(inst5_out), .IN7(inst55_out), .IN6(inst53_out), .IN5(inst40_out),
    .IN4(inst15_out), .IN3(inst8_out), .IN2(inst7_out), .OUT(n53_out));
  XOR8 u_54 (
    .IN8(inst65_out_2), .IN1(inst8_out), .IN7(inst65_out_2), .IN6(inst65_out_2), .IN5(inst65_out_2),
    .IN4(inst56_out), .IN3(inst15_out), .IN2(inst21_out), .OUT(n54_out));
  XOR8 u_55 (
    .IN8(inst65_out_2), .IN1(inst5_out), .IN7(inst65_out_2), .IN6(inst65_out_2), .IN5(inst65_out_2),
    .IN4(inst53_out), .IN3(inst25_out), .IN2(inst22_out), .OUT(n55_out));
  XOR8 u_56 (
    .IN8(inst54_out), .IN1(inst5_out), .IN7(inst40_out), .IN6(inst39_out), .IN5(inst15_out),
    .IN4(inst23_out), .IN3(inst7_out), .IN2(inst6_out), .OUT(n56_out));
  xor inst213 (inst213_out, inst55_out, n56_out);
  XOR8 u_57 (
    .IN8(inst60_out), .IN1(inst9_out), .IN7(inst59_out), .IN6(inst57_out), .IN5(inst44_out),
    .IN4(inst28_out), .IN3(inst12_out), .IN2(inst11_out), .OUT(n57_out));
  XOR8 u_58 (
    .IN8(inst65_out_2), .IN1(inst25_out), .IN7(inst65_out_2), .IN6(inst65_out_2), .IN5(inst60_out),
    .IN4(inst12_out), .IN3(inst65_out_2), .IN2(inst41_out), .OUT(n58_out));
  XOR8 u_59 (
    .IN8(inst65_out_2), .IN1(inst9_out), .IN7(inst65_out_2), .IN6(inst65_out_2), .IN5(inst65_out_2),
    .IN4(inst57_out), .IN3(inst42_out), .IN2(inst26_out), .OUT(n59_out));
  XOR8 u_60 (
    .IN8(inst57_out), .IN1(inst9_out), .IN7(inst44_out), .IN6(inst43_out), .IN5(inst28_out),
    .IN4(inst27_out), .IN3(inst11_out), .IN2(inst10_out), .OUT(n60_out));
  XOR3 inst96 (.IN3(inst58_out), .IN1(inst59_out), .IN2(n60_out), .OUT(inst96_out));
  XOR8 u_61 (
    .IN8(inst64_out), .IN1(inst13_out), .IN7(inst63_out), .IN6(inst61_out), .IN5(inst48_out),
    .IN4(inst32_out), .IN3(inst16_out), .IN2(inst15_out), .OUT(n61_out));
  XOR8 u_62 (
    .IN8(inst65_out_2), .IN1(inst16_out), .IN7(inst65_out_2), .IN6(inst65_out_2), .IN5(inst65_out_2),
    .IN4(inst64_out), .IN3(inst45_out), .IN2(inst29_out), .OUT(n62_out));
  XOR8 u_63 (
    .IN8(inst65_out_2), .IN1(inst13_out), .IN7(inst65_out_2), .IN6(inst65_out_2), .IN5(inst65_out_2),
    .IN4(inst61_out), .IN3(inst46_out), .IN2(inst30_out), .OUT(n63_out));
  XOR8 u_64 (
    .IN8(inst62_out), .IN1(inst13_out), .IN7(inst61_out), .IN6(inst47_out), .IN5(inst32_out),
    .IN4(inst31_out), .IN3(inst15_out), .IN2(inst14_out), .OUT(n64_out));
  xor inst214 (inst214_out, inst63_out, n64_out);

  assign pin_name11 = pin_name10;
  assign rc5 = rc4;
endmodule
